# Altium project My驱动_V5.PrjPcb
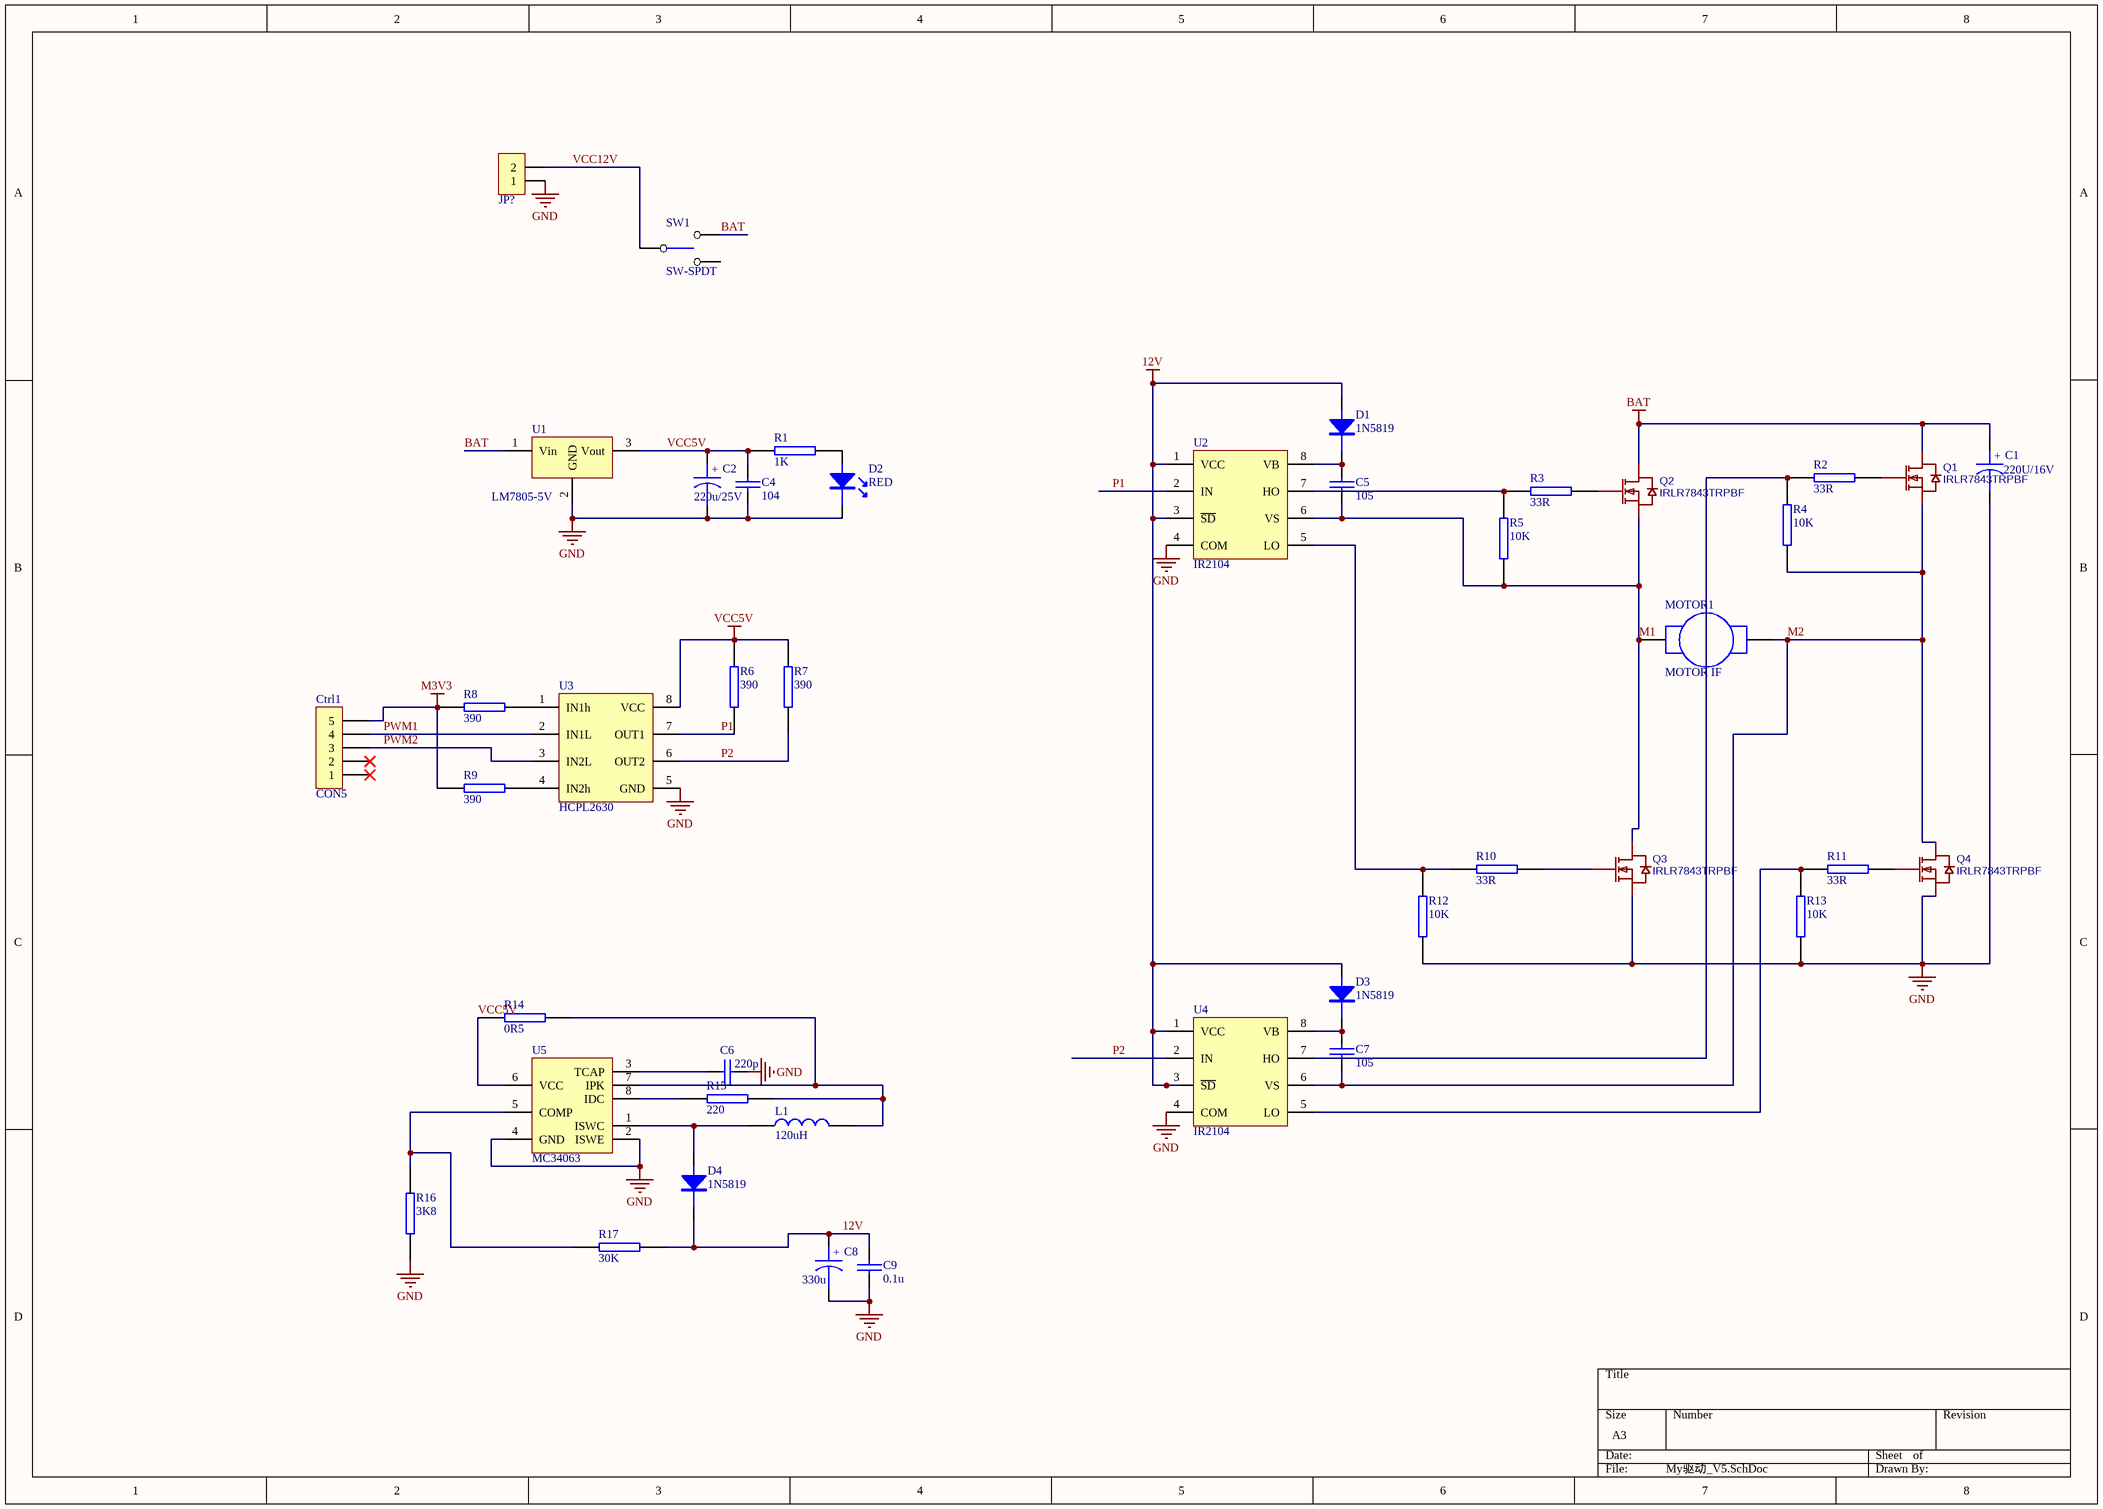
[diagram p0: My驱动_V5.SchDoc]
1 sheet, 43 parts. Net scope: global (net labels, ports and power ports of the same name join across sheets).
Board file: My驱动_V5.PcbDoc

## Sheet My驱动_V5.SchDoc
size A3

### Parts
C1  220U/16V  [CAP-TH_BD6.3-P2.50-D1.0-FD]
C2  220u/25V  [CAP-TH_BD6.3-P2.50-D1.0-FD]
C4  104  [LQ_0603]
C5  105  [LQ_0603]
C6  220p  [LQ_0603]
C7  105  [LQ_0603]
C8  330u  [CAP-TH_BD6.3-P2.50-D1.0-FD]
C9  0.1u  [LQ_0603]
Ctrl1  CON5  [LQ_SIP5]
D1  1N5819  [SOD-123]
D2  RED  [LQ_0603D]
D3  1N5819  [SOD-123]
D4  1N5819  [SOD-123]
JP?  HDR-1X2  [KF301-5.0-2P]  (value not drawn)
L1  120uH  [LQ_1210]
MOTOR1  MOTOR IF  [LQ_PIN2]
Q1  IRLR7843TRPBF  [TO-252-2_L6.5-W6.1-P4.58-LS10.0-TR]
Q2  IRLR7843TRPBF  [TO-252-2_L6.5-W6.1-P4.58-LS10.0-TR]
Q3  IRLR7843TRPBF  [TO-252-2_L6.5-W6.1-P4.58-LS10.0-TR]
Q4  IRLR7843TRPBF  [TO-252-2_L6.5-W6.1-P4.58-LS10.0-TR]
R1  1K  [LQ_0805]
R2  33R  [LQ_0805]
R3  33R  [LQ_0805]
R4  10K  [LQ_0805]
R5  10K  [LQ_0805]
R6  390  [LQ_0805]
R7  390  [LQ_0805]
R8  390  [LQ_0805]
R9  390  [LQ_0805]
R10  33R  [LQ_0805]
R11  33R  [LQ_0805]
R12  10K  [LQ_0805]
R13  10K  [LQ_0805]
R14  0R5  [LQ_0805]
R15  220  [LQ_0805]
R16  3K8  [LQ_0805]
R17  30K  [LQ_0805]
SW1  SW-SPDT  [LQ_SWSIP3]
U1  LM7805-5V  [LQ_DPAK]
U2  IR2104  [SO-8]
U3  HCPL2630  [DIP8]
U4  IR2104  [SO-8]
U5  MC34063  [SO-8]

### Nets
12V: C8.1 C9.1 D1.2 D3.2 D4.1 R17.1 U2.1(VCC) U2.3(~{SD}) U4.1(VCC) U4.3(~{SD})
BAT: C1.1 Q1.4(D) Q2.4(D) SW1.2 U1.1(Vin)
GND: C1.2 C2.2 C4.2 C6.2 C8.2 C9.2 D2.2 JP?.1 Q3.3(S) Q4.3(S) R12.2 R13.1 R16.1 U1.2(GND) U2.4(COM) U3.5(GND) U4.4(COM) U5.2(ISWE) U5.4(GND)
M3V3: Ctrl1.5 R8.2 R9.2
VCC5V: C2.1 C4.1 R1.1 R6.2 R7.2 R14.1 U1.3(Vout) U3.8(VCC) U5.6(VCC)
M1: C5.2 MOTOR1.1 Q2.3(S) Q3.4(D) R5.1 U2.6(VS)
M2: C7.2 MOTOR1.2 Q1.3(S) Q4.4(D) R4.2 U4.6(VS)
P1: R6.1 U2.2(IN) U3.7(OUT1)
P2: R7.1 U3.6(OUT2) U4.2(IN)
PWM1: Ctrl1.4 U3.2(IN1L)
PWM2: Ctrl1.3 U3.3(IN2L)
VCC12V: JP?.2 SW1.1
NetC5_1: C5.1 D1.1 U2.8(VB)
NetC6_1: C6.1 U5.3(TCAP)
NetC7_1: C7.1 D3.1 U4.8(VB)
NetD2_1: D2.1 R1.2
NetD4_2: D4.2 L1.1 U5.1(ISWC)
NetL1_2: L1.2 R14.2 R15.2 U5.7(IPK)
NetQ1_1: Q1.1(G) R2.1
NetQ2_1: Q2.1(G) R3.2
NetQ3_1: Q3.1(G) R10.1
NetQ4_1: Q4.1(G) R11.2
NetR2_2: R2.2 R4.1 U4.7(HO)
NetR3_1: R3.1 R5.2 U2.7(HO)
NetR8_1: R8.1 U3.1(IN1h)
NetR9_1: R9.1 U3.4(IN2h)
NetR10_2: R10.2 R12.1 U2.5(LO)
NetR11_1: R11.1 R13.2 U4.5(LO)
NetR15_1: R15.1 U5.8(IDC)
NetR16_2: R16.2 R17.2 U5.5(COMP)

Not connected (* = marked no-connect by the designer): Ctrl1 1* 2*; SW1 3

### Notes on the sheet
- (in symbol CAPACITOR POL) +

### Library data of the parts
C1 C2 C8 = CAPACITOR POL: Capacitor
C4-C7 C9 = CAP: Capacitor
Ctrl1 = CON5: Connector
D1 D3 D4 = LQ_DIODE
D2 = LQ_LED
JP? = Header 2_1: 2P接插件; 版权归属: 源创客; BOM名称: 2P接插件; 学习资源: www.ooocke.com
L1 = INDUCTOR
MOTOR1 = MOTOR AC
Q1-Q4 = IRLR7843TRPBF: BOM_Manufacturer: IR; BOM_Supplier: LCSC; BOM_Manufacturer Part: IRLR7843TRPBF; BOM_Supplier Part: C21988; BOM_JLCPCB Part Class: Extended Part; spicePre: Q; spiceSymbolName: IRLR7843TRPBF
R1-R17 = RES2
U1 = LM7805
U3 = HCPL2630: 6N137 2631